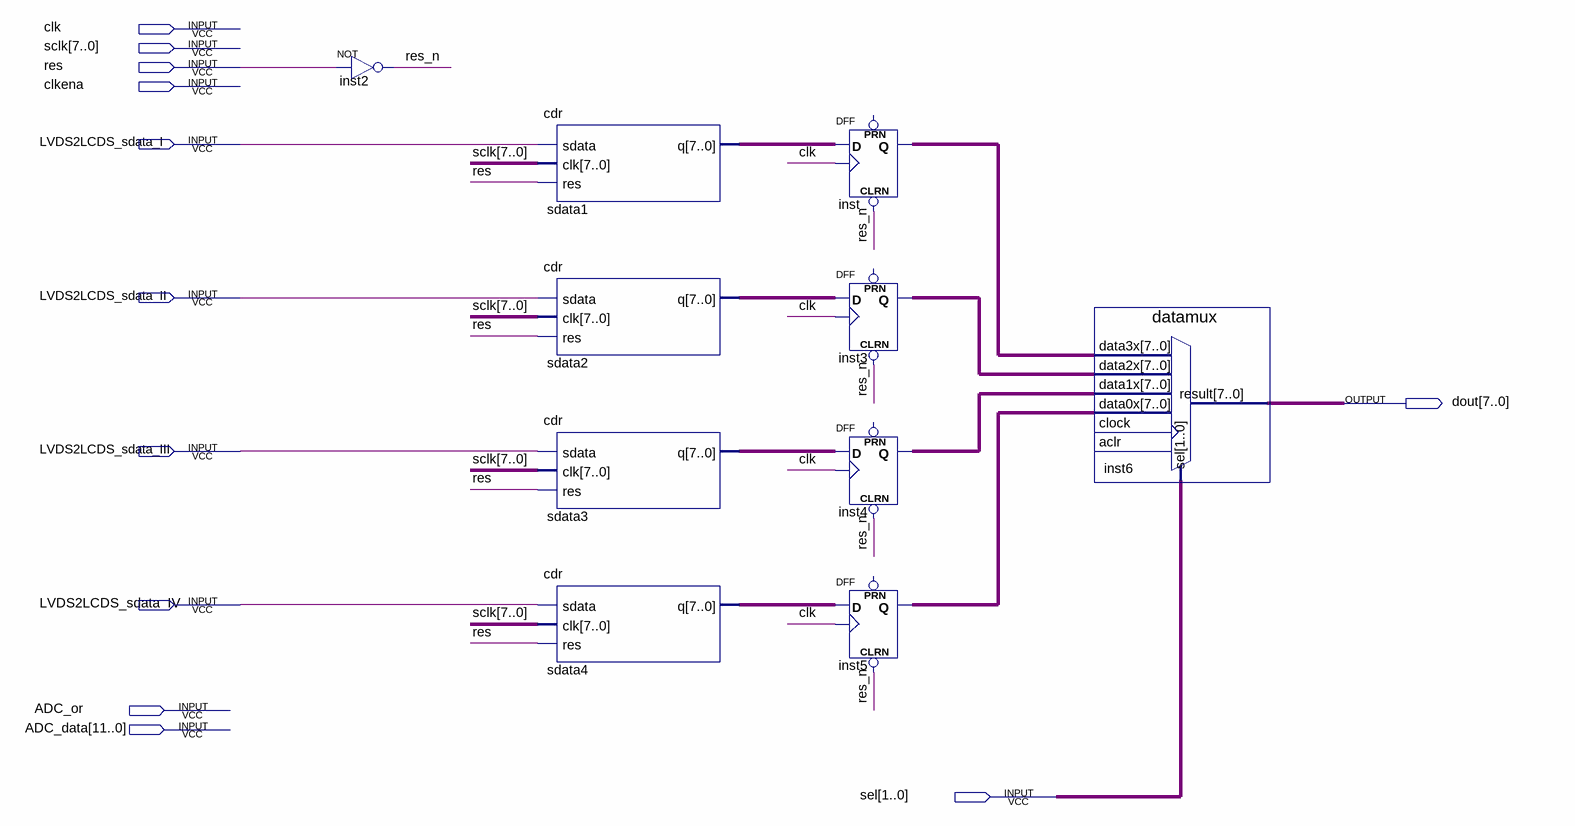
[diagram p0: schematic sheet]
// Quartus schematic FED.bdf as structural Verilog: 10 symbols, 12 pins
module FED (
  input  clk,
  input  [7:0] sclk,
  input  res,
  input  clkena,
  input  LVDS2LCDS_sdata_I,
  input  LVDS2LCDS_sdata_II,
  input  LVDS2LCDS_sdata_III,
  input  LVDS2LCDS_sdata_IV,
  input  ADC_or,
  input  [11:0] ADC_data,
  input  [1:0] sel,
  output [7:0] dout
);

  wire res_n;
  wire [7:0] inst3_q, inst4_q, inst5_q, inst_q, sdata1_q, sdata2_q, sdata3_q, sdata4_q;

  not inst2 (res_n, res);
  cdr sdata1 (.res(res), .sdata(LVDS2LCDS_sdata_I), .clk(sclk), .q(sdata1_q));
  cdr sdata2 (.res(res), .sdata(LVDS2LCDS_sdata_II), .clk(sclk), .q(sdata2_q));
  cdr sdata3 (.res(res), .sdata(LVDS2LCDS_sdata_III), .clk(sclk), .q(sdata3_q));
  cdr sdata4 (.res(res), .sdata(LVDS2LCDS_sdata_IV), .clk(sclk), .q(sdata4_q));
  DFF inst[7:0] (.CLRN(res_n), .CLK(clk), .D(sdata1_q), .Q(inst_q));  // open: PRN
  DFF inst3[7:0] (.CLRN(res_n), .CLK(clk), .D(sdata2_q), .Q(inst3_q));  // open: PRN
  DFF inst4[7:0] (.CLRN(res_n), .CLK(clk), .D(sdata3_q), .Q(inst4_q));  // open: PRN
  DFF inst5[7:0] (.CLRN(res_n), .CLK(clk), .D(sdata4_q), .Q(inst5_q));  // open: PRN
  datamux inst6 (
    .data3x(inst_q), .data2x(inst3_q), .data1x(inst4_q), .data0x(inst5_q), .sel(sel), .result(dout));  // open: clock, aclr
endmodule
